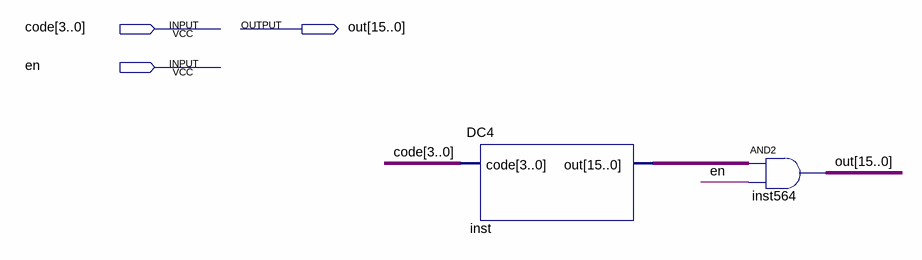
[diagram p0: schematic sheet]
// Quartus schematic DCE4.bdf as structural Verilog: 2 symbols, 3 pins
module DCE4 (
  input  [3:0] code,
  input  en,
  output [15:0] out
);

  wire [15:0] inst_out;

  DC4 inst (.code(code), .out(inst_out));
  assign out = inst_out & {16{en}};  // AND2 inst564, 16 bits wide
endmodule
